# Altium schematic sheet 425AK01A_S08.SchDoc
size A3; DocumentNumber: 8; SheetNumber: 8; SheetTotal: 10; PageSetup: Record=PageOptions|CenterHorizontal=True|CenterVertical=True|PrintScale=1.01|XCorrection=1.00|YCorrection=1.00|PrintKind=1|BorderSize=5000000|LeftOffset=0|BottomOffset=0|Orientation=2|PaperLength=1000|PaperWidth=1000|Scale=100|PaperSource=15|PrintQuality=600|MediaType=1|DitherType=10|PaperKind=A3|PrintScaleMode=1; 00_Drawn: RJG; 00_Date: 8APR2022; 00_Checked: SR; 00_Approved: GN; 00_Line1: Clock Buffer Circuits, RSB B
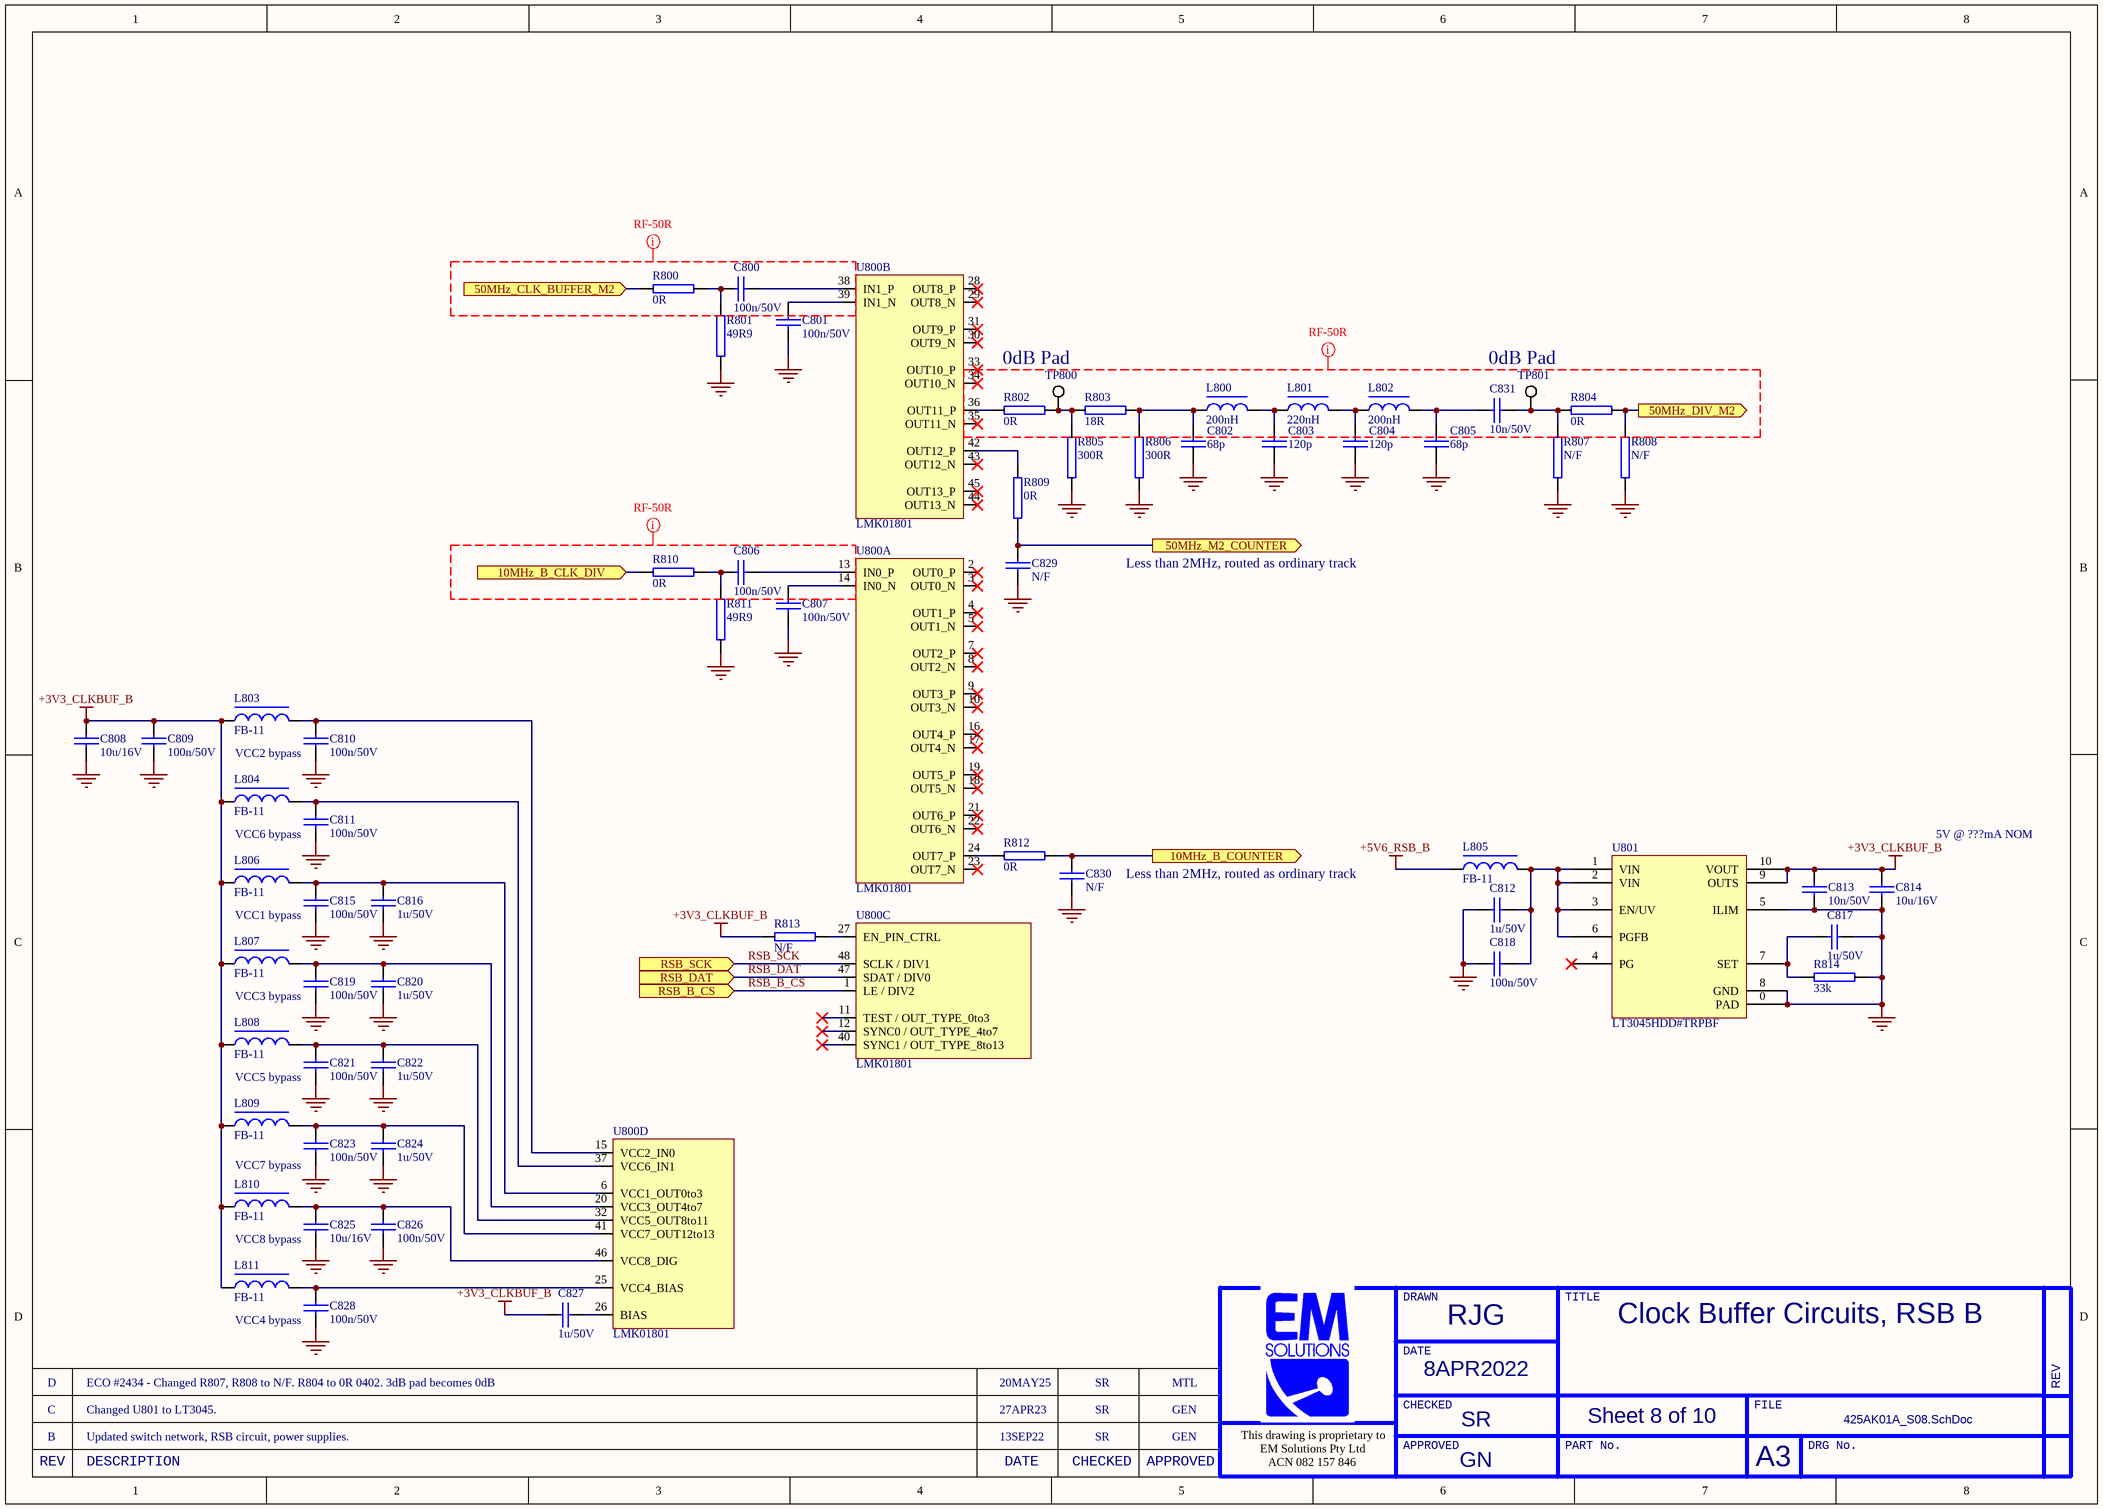
[diagram p0: 425AK01A_S08.SchDoc]

## Parts
C800  100n/50V  [0402C]
C801  100n/50V  [0402C]
C802  68p  [0402C]
C803  120p  [0402C]
C804  120p  [0402C]
C805  68p  [0402C]
C806  100n/50V  [0402C]
C807  100n/50V  [0402C]
C808  10u/16V  [0805C]
C809  100n/50V  [0402C]
C810  100n/50V  [0402C]
C811  100n/50V  [0402C]
C812  1u/50V  [0603C]
C813  10n/50V  [0402C]
C814  10u/16V  [0805C]
C815  100n/50V  [0402C]
C816  1u/50V  [0603C]
C817  1u/50V  [0603C]
C818  100n/50V  [0402C]
C819  100n/50V  [0402C]
C820  1u/50V  [0603C]
C821  100n/50V  [0402C]
C822  1u/50V  [0603C]
C823  100n/50V  [0402C]
C824  1u/50V  [0603C]
C825  10u/16V  [0805C]
C826  100n/50V  [0402C]
C827  1u/50V  [0603C]
C828  100n/50V  [0402C]
C829  N/F  [0402C]
C830  N/F  [0402C]
C831  10n/50V  [0402C]
L800  200nH  [0402L]
L801  220nH  [0402L]
L802  200nH  [0402L]
L803  FB-11  [0402L]
L804  FB-11  [0402L]
L805  FB-11  [0402L]
L806  FB-11  [0402L]
L807  FB-11  [0402L]
L808  FB-11  [0402L]
L809  FB-11  [0402L]
L810  FB-11  [0402L]
L811  FB-11  [0402L]
R800  0R  [0402]
R801  49R9  [0402]
R802  0R  [0402]
R803  18R  [0402]
R804  0R  [0402]
R805  300R  [0402]
R806  300R  [0402]
R807  N/F  [0402]
R808  N/F  [0402]
R809  0R  [0402]
R810  0R  [0402]
R811  49R9  [0402]
R812  0R  [0402]
R813  N/F  [0402]
R814  33k  [0402]
TP800  Pad  [Testpoint-0.5mm-SMT-withPaste]  (value not drawn)  (no BOM)
TP801  Pad  [Testpoint-0.5mm-SMT-withPaste]  (value not drawn)  (no BOM)
U800  LMK01801  [SQA48]  (parts A,B,C,D of 4)
U801  LT3045HDD#TRPBF  [DFN50P300X300X80_HS-11N]

## Ports
10MHz_B_CLK_DIV (in), 10MHz_B_COUNTER (out), 50MHz_CLK_BUFFER_M2 (in), 50MHz_DIV_M2 (out), 50MHz_M2_COUNTER (out), RSB_B_CS (in), RSB_DAT (in), RSB_SCK (in)

## Nets
+3V3_CLKBUF_B: C808.1 C809.1 C813.2 C814.1 C827.2 L803.1 L804.1 L806.1 L807.1 L808.1 L809.1 L810.1 L811.1 R813.1 U801.9(OUTS) U801.10(VOUT)
+5V6_RSB_B: L805.2
GND: C801.2 C802.1 C803.1 C804.1 C805.1 C807.2 C808.2 C809.2 C810.2 C811.1 C812.1 C813.1 C814.2 C815.2 C816.2 C817.2 C818.2 C819.2 C820.2 C821.2 C822.2 C823.2 C824.2 C825.2 C826.2 C828.1 C829.2 C830.2 R801.1 R805.2 R806.2 R807.2 R808.2 R811.1 R814.1 U800.0(EP) U801.0(PAD) U801.5(ILIM) U801.8(GND)
10MHz_B_CLK_DIV: R810.2 ; port 10MHz_B_CLK_DIV
10MHz_B_COUNTER: C830.1 R812.1 ; port 10MHz_B_COUNTER
50MHz_CLK_BUFFER_M2: R800.2 ; port 50MHz_CLK_BUFFER_M2
50MHz_DIV_M2: R804.1 R808.1 ; port 50MHz_DIV_M2
50MHz_M2_COUNTER: C829.1 R809.1 ; port 50MHz_M2_COUNTER
RSB_B_CS: U800.1(LE_/_DIV2) ; port RSB_B_CS
RSB_DAT: U800.47(SDAT_/_DIV0) ; port RSB_DAT
RSB_SCK: U800.48(SCLK_/_DIV1) ; port RSB_SCK
NetC800_1: C800.1 U800.38(IN1_P)
NetC800_2: C800.2 R800.1 R801.2
NetC801_1: C801.1 U800.39(IN1_N)
NetC802_2: C802.2 L800.1 R803.1 R806.1
NetC803_2: C803.2 L800.2 L801.1
NetC804_2: C804.2 L801.2 L802.1
NetC805_2: C805.2 C831.2 L802.2
NetC806_1: C806.1 U800.13(IN0_P)
NetC806_2: C806.2 R810.1 R811.2
NetC807_1: C807.1 U800.14(IN0_N)
NetC810_1: C810.1 L803.2 U800.15(VCC2_IN0)
NetC811_2: C811.2 L804.2 U800.37(VCC6_IN1)
NetC812_2: C812.2 C818.1 L805.1 U801.1(VIN) U801.2(VIN) U801.3(EN/UV) U801.6(PGFB)
NetC815_1: C815.1 C816.1 L806.2 U800.6(VCC1_OUT0to3)
NetC817_1: C817.1 R814.2 U801.7(SET)
NetC819_1: C819.1 C820.1 L807.2 U800.20(VCC3_OUT4to7)
NetC821_1: C821.1 C822.1 L808.2 U800.32(VCC5_OUT8to11)
NetC823_1: C823.1 C824.1 L809.2 U800.41(VCC7_OUT12to13)
NetC825_1: C825.1 C826.1 L810.2 U800.46(VCC8_DIG)
NetC827_1: C827.1 U800.26(BIAS)
NetC828_2: C828.2 L811.2 U800.25(VCC4_BIAS)
NetC831_1: C831.1 R804.2 R807.1 TP801.1
NetR802_1: R802.1 R803.2 R805.1 TP800.1
NetR802_2: R802.2 U800.36(OUT11_P)
NetR809_2: R809.2 U800.42(OUT12_P)
NetR812_2: R812.2 U800.24(OUT7_P)
NetR813_2: R813.2 U800.27(EN_PIN_CTRL)

Not connected (* = marked no-connect by the designer): U800 2(OUT0_P)* 3(OUT0_N)* 4(OUT1_P)* 5(OUT1_N)* 7(OUT2_P)* 8(OUT2_N)* 9(OUT3_P)* 10(OUT3_N)* 11(TEST_/_OUT_TYPE_0to3)* 12(SYNC0_/_OUT_TYPE_4to7)* 16(OUT4_P)* 17(OUT4_N)* 18(OUT5_N)* 19(OUT5_P)* 21(OUT6_P)* 22(OUT6_N)* 23(OUT7_N)* 28(OUT8_P)* 29(OUT8_N)* 30(OUT9_N)* 31(OUT9_P)* 33(OUT10_P)* 34(OUT10_N)* 35(OUT11_N)* 40(SYNC1_/_OUT_TYPE_8to13)* 43(OUT12_N)* 44(OUT13_N)* 45(OUT13_P)*; U801 4(PG)*

## Layout directives
net class RF-50R: (no net found under the mark)

## Notes on the sheet
- 0dB Pad
- Less than 2MHz, routed as ordinary track
- (near C810) VCC2 bypass
- (near C811) VCC6 bypass
- 5V @ ???mA NOM
- (near C815) VCC1 bypass
- (near C819) VCC3 bypass
- (near C821) VCC5 bypass
- (near C823) VCC7 bypass
- (near C825) VCC8 bypass
- (near C828) VCC4 bypass
- D
- ECO #2434 - Changed R807, R808 to N/F. R804 to 0R 0402. 3dB pad becomes 0dB
- 20MAY25
- SR
- MTL
- B
- C
- Updated switch network, RSB circuit, power supplies.
- Changed U801 to LT3045.
- 13SEP22
- 27APR23
- GEN
- DRAWN
- TITLE
- DATE
- REV
- This drawing is proprietary to
- EM Solutions Pty Ltd
- APPROVED
- CHECKED
- PART No.
- FILE
- A3
- DRG No.
- DESCRIPTION
- ACN 082 157 846

## Library data of the parts
C800 C801 C806 C807 C809-C811 C815 C818 C819 C821 C823 C826 C828 = 41-100N-13: Capacitor, 0402, 100n, X7R, 10% 50V, Ceramic; MANUFACTURER: MURATA; ID: 2441; MODELNAME: GRM155R71H104KE14J; Part Number: 41-100N-13; ItemID: 41-100N-13
C802 C805 = 41-068P-08: Capacitor, 0402, 68p; Part Number: 41-068P-08
C803 C804 = 41-120P-05: Capacitor, 0402, 120p NPO; Part Number: 41-120P-05
C808 C825 = 41-010U-08: Capacitor, 0805, 10u X5R 10% 16V Ceramic, NiSn; Part Number: 41-010U-08
C812 C817 = 41-01U0-06: Capacitor, 0603, 1u X7R 10% 50V Ceramic, NiSn; MANUFACTURER: TAIYOYUDEN; MODELNAME: UMK107AB7105KA; ID: 2287; Part Number: 41-01U0-06; ItemID: 41-01U0-06
C813 C831 = 41-010N-12: Capacitor, 0402, 10n X7R 10% 50V Ceramic, NiSn; MANUFACTURER: MURATA; ID: 2217; MODELNAME: GCM155R71H103KA55D; Part Number: 41-010N-12; ItemID: 41-010N-12
C814 = 41-010U-08: Capacitor, 0805, 10u X7R 10% 16V Ceramic, NiSn; MANUFACTURER: SAMSUNG; ID: 2232; MODELNAME: CL21B106KOQNNNE; Part Number: 41-010U-08; ItemID: 41-010U-08
C816 C820 C822 C824 C827 = 41-01U0-06: Capacitor, 0603, 1u X7R 10% 50V Ceramic, NiSn; MANUFACTURER: TAIYOYUDEN; ID: 2287; MODELNAME: UMK107AB7105KA; Part Number: 41-01U0-06; ItemID: 41-01U0-06
C829 C830 = 41-N/F-04: Capacitor, 0402, SOT, Not Fitted; ID: 2511; Part Number: 41-N/F-04; ItemID: 41-N/F-04
L800 L802 = 46-200N-04: Inductor, Chip, 200nH, 0402; Part Number: 46-200N-04
L801 = 46-220N-05: Inductor, Chip, 220nH, 0402; Part Number: 46-220N-05
L803 L804 L806-L811 = 46-B-11: Solid Inductor, 600ohm@100MHz, DCR=0.52, 0.3A, 0402 size; MANUFACTURER: TDK; ID: 3256; MODELNAME: MMZ1005S601C; Part Number: 46-B-11; ItemID: 46-B-11
L805 = 46-B-11: Solid Inductor, 600ohm@100MHz, DCR=0.52, 0.3A, 0402 size; MANUFACTURER: TDK; MODELNAME: MMZ1005S601C; ID: 3256; Part Number: 46-B-11; ItemID: 46-B-11
R800 R802 R809 R810 R812 = 44-000R-10: Resistor, 0402, 0R 1% 0.063W; MANUFACTURER: GENERIC; ID: 2538; Part Number: 44-000R-10; ItemID: 44-000R-10; MODELNAME: GENERIC
R801 R811 = 44-049R9-10: Resistor, 0402, 49R9 1% 0.063W; ID: 2787; MODELNAME: RC0402FR-0749R9L; Part Number: 44-049R9-10; ItemID: 44-049R9-10
R803 = 44-018R-10: Resistor, 0402, 18R 1% 0.063W; MANUFACTURER: GENERIC; ID: 2594; Part Number: 44-018R-10; ItemID: 44-018R-10; MODELNAME: GENERIC
R804 = 44-000R-10: Resistor, 0402, 0R 1% 0.063W 1A; ID: 2538; MODELNAME: CRG0402ZR; Part Number: 44-000R-10; ItemID: 44-000R-10
R805 R806 = 44-300R-10: Resistor, 0402, 300R 1% 0.063W; MANUFACTURER: GENERIC; ID: 3023; Part Number: 44-300R-10; ItemID: 44-300R-10; MODELNAME: GENERIC
R807 R808 R813 = 44-N/F-10: Resistor, 0402, SOT, Not Fitted; ID: 3111; Part Number: 44-N/F-10; ItemID: 44-N/F-10
R814 = 44-033K-10: Resistor, 0402, 33k 1% 0.063W; MANUFACTURER: GENERIC; ID: 2720; Part Number: 44-033K-10; ItemID: 44-033K-10; MODELNAME: GENERIC
TP800 TP801 = Pad: Pad that can be a test point or a hot via
U800 = LMK01801: Dual Clock Divider Buffer; Part Number: 53-01801-01
U801 = 52-3045-01: Volt Regulator, Vin=1.8-20V, 500mA, LDO, Low Noise, 10-DFN (3x3), -40to+150C; MANUFACTURER: ANLG DEV; ID: 3362; Part Number: 52-3045-01; MODELNAME: LT3045HDD#TRPBF; ItemID: 52-3045-01